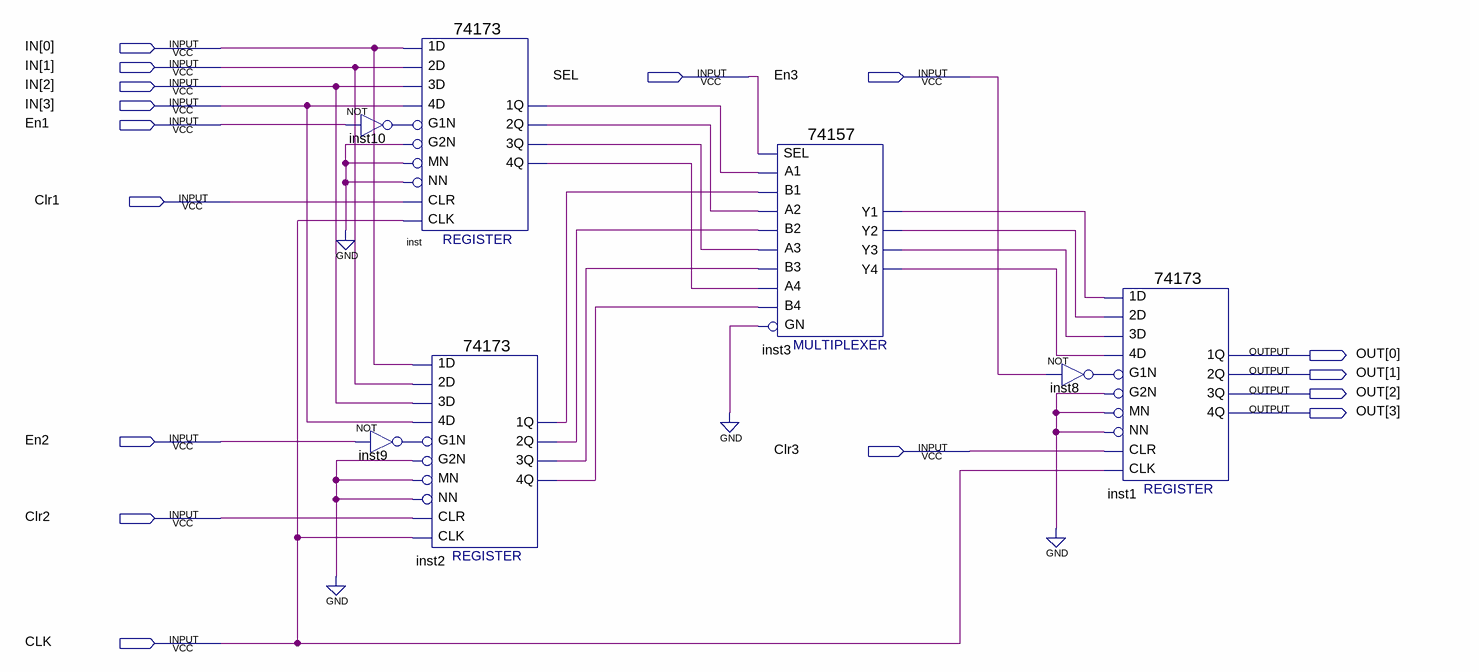
[diagram p0: schematic sheet]
// Quartus schematic FluxoDeDados.bdf as structural Verilog: 7 symbols, 16 pins
module FluxoDeDados (
  input  [3:0] IN,
  input  SEL,
  input  En3,
  input  En1,
  input  Clr1,
  input  En2,
  input  Clr3,
  input  Clr2,
  input  CLK,
  output [3:0] OUT
);

  wire inst2_1q, inst2_2q, inst2_3q, inst2_4q, inst3_y1, inst3_y2, inst3_y3, inst3_y4, inst8_out, inst9_out,
       inst10_out, inst_1q, inst_2q, inst_3q, inst_4q;

  \74173  inst (
    .\3D (IN[2]), .MN(1'b0), .\1D (IN[0]), .\2D (IN[1]), .\4D (IN[3]), .G1N(inst10_out), .G2N(1'b0),
    .NN(1'b0), .CLR(Clr1), .CLK(CLK), .\3Q (inst_3q), .\2Q (inst_2q), .\1Q (inst_1q), .\4Q (inst_4q));
  not inst10 (inst10_out, En1);
  \74173  inst2 (
    .\3D (IN[2]), .MN(1'b0), .\1D (IN[0]), .\2D (IN[1]), .\4D (IN[3]), .G1N(inst9_out), .G2N(1'b0),
    .NN(1'b0), .CLR(Clr2), .CLK(CLK), .\3Q (inst2_3q), .\2Q (inst2_2q), .\1Q (inst2_1q), .\4Q (inst2_4q));
  not inst9 (inst9_out, En2);
  \74157  inst3 (
    .A1(inst_1q), .B1(inst2_1q), .SEL(SEL), .B2(inst2_2q), .A3(inst_3q), .B3(inst2_3q), .A2(inst_2q),
    .B4(inst2_4q), .GN(1'b0), .A4(inst_4q), .Y2(inst3_y2), .Y1(inst3_y1), .Y4(inst3_y4), .Y3(inst3_y3));
  \74173  inst1 (
    .\3D (inst3_y3), .MN(1'b0), .\1D (inst3_y1), .\2D (inst3_y2), .\4D (inst3_y4), .G1N(inst8_out),
    .G2N(1'b0), .NN(1'b0), .CLR(Clr3), .CLK(CLK), .\3Q (OUT[2]), .\2Q (OUT[1]), .\1Q (OUT[0]), .\4Q (OUT[3]));
  not inst8 (inst8_out, En3);
endmodule
